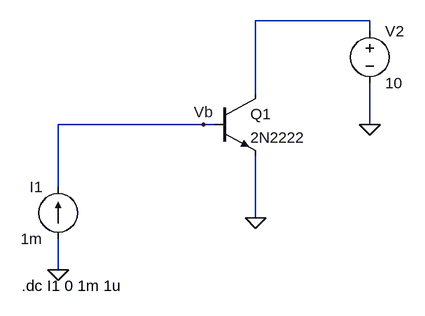
[diagram p0: schematic Assignment 4.1 BJT.asc]
Assignment 4.1 BJT.asc, the LTspice schematic file:
Version 4.1
SHEET 1 880 680
WIRE 464 -64 288 -64
WIRE 464 -48 464 -64
WIRE 288 48 288 -64
WIRE 208 96 -16 96
WIRE 224 96 208 96
WIRE 464 96 464 32
WIRE -16 192 -16 96
WIRE 288 240 288 144
WIRE -16 320 -16 272
FLAG -16 320 0
FLAG 464 96 0
FLAG 288 240 0
FLAG 208 96 Vb
SYMBOL npn 224 48 R0
SYMATTR InstName Q1
SYMATTR Value 2N2222
SYMBOL voltage 464 -64 R0
SYMATTR InstName V2
SYMATTR Value 10
SYMBOL current -16 272 R180
WINDOW 0 24 80 Left 2
WINDOW 3 24 0 Left 2
SYMATTR InstName I1
SYMATTR Value 1m
TEXT -72 344 Left 2 !.dc I1 0 1m 1u

The netlist it stands for:
* Assignment 4.1 BJT.asc
Q1 N001 Vb 0 0 2N2222
V2 N001 0 10
I1 0 Vb 1m
.model NPN NPN
.model PNP PNP
.lib standard.bjt
.dc I1 0 1m 1u
.backanno
.end